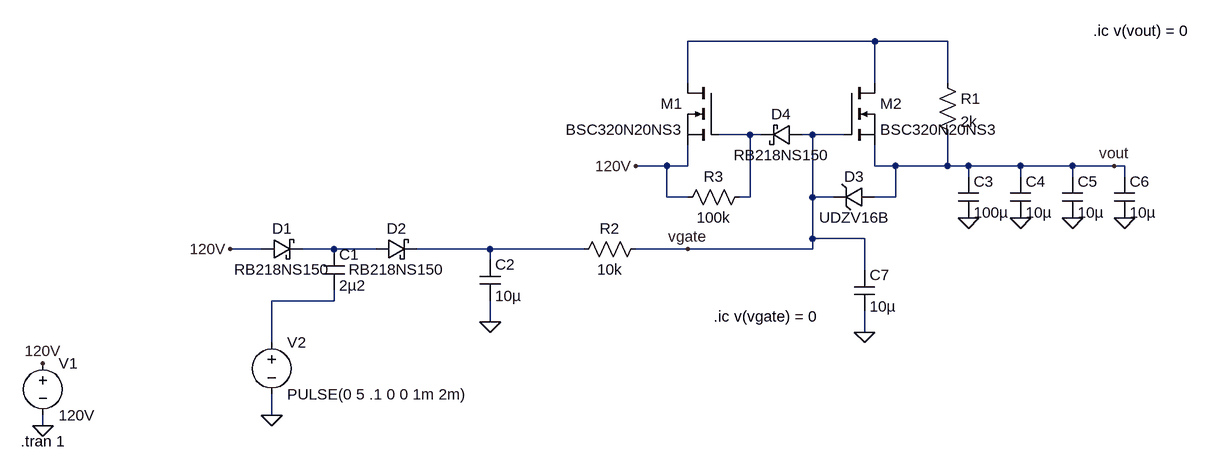
[diagram p0: schematic SoftStart+revPol_highVoltage.asc]
SoftStart+revPol_highVoltage.asc, the LTspice schematic file:
Version 4
SHEET 1 1836 680
WIRE 1344 -368 1056 -368
WIRE 1456 -368 1344 -368
WIRE 1056 -304 1056 -368
WIRE 1344 -304 1344 -368
WIRE 1456 -304 1456 -368
WIRE 1152 -224 1104 -224
WIRE 1168 -224 1152 -224
WIRE 1248 -224 1232 -224
WIRE 1296 -224 1248 -224
WIRE 1024 -176 976 -176
WIRE 1056 -176 1056 -208
WIRE 1056 -176 1024 -176
WIRE 1344 -176 1344 -208
WIRE 1376 -176 1344 -176
WIRE 1456 -176 1456 -224
WIRE 1456 -176 1376 -176
WIRE 1488 -176 1456 -176
WIRE 1568 -176 1488 -176
WIRE 1648 -176 1568 -176
WIRE 1712 -176 1648 -176
WIRE 1728 -176 1712 -176
WIRE 1488 -160 1488 -176
WIRE 1568 -160 1568 -176
WIRE 1648 -160 1648 -176
WIRE 1728 -160 1728 -176
WIRE 1024 -128 1024 -176
WIRE 1056 -128 1024 -128
WIRE 1152 -128 1152 -224
WIRE 1152 -128 1136 -128
WIRE 1248 -128 1248 -224
WIRE 1280 -128 1248 -128
WIRE 1376 -128 1376 -176
WIRE 1376 -128 1344 -128
WIRE 1248 -64 1248 -128
WIRE 1328 -64 1248 -64
WIRE 400 -48 352 -48
WIRE 512 -48 464 -48
WIRE 576 -48 512 -48
WIRE 752 -48 640 -48
WIRE 896 -48 752 -48
WIRE 1056 -48 976 -48
WIRE 1248 -48 1248 -64
WIRE 1248 -48 1056 -48
WIRE 752 -32 752 -48
WIRE 1328 -16 1328 -64
WIRE 512 32 512 16
WIRE 512 32 416 32
WIRE 752 64 752 32
WIRE 1328 80 1328 48
WIRE 416 96 416 32
WIRE 416 208 416 176
WIRE 64 224 64 208
FLAG 64 224 0
FLAG 64 128 120V
FLAG 416 208 0
FLAG 352 -48 120V
FLAG 752 64 0
FLAG 976 -176 120V
FLAG 1488 -96 0
FLAG 1568 -96 0
FLAG 1648 -96 0
FLAG 1728 -96 0
FLAG 1712 -176 vout
FLAG 1056 -48 vgate
FLAG 1328 80 0
SYMBOL voltage 64 112 R0
WINDOW 123 0 0 Left 0
WINDOW 39 0 0 Left 0
SYMATTR InstName V1
SYMATTR Value 120V
SYMBOL cap 496 -48 R0
SYMATTR InstName C1
SYMATTR Value 2µ2
SYMBOL voltage 416 80 R0
WINDOW 123 0 0 Left 0
WINDOW 39 0 0 Left 0
SYMATTR InstName V2
SYMATTR Value PULSE(0 5 .1 0 0 1m 2m)
SYMBOL schottky 400 -32 R270
WINDOW 0 32 32 VTop 2
WINDOW 3 0 32 VBottom 2
SYMATTR InstName D1
SYMATTR Value RB218NS150
SYMATTR Description Diode
SYMATTR Type diode
SYMBOL schottky 576 -32 R270
WINDOW 0 32 32 VTop 2
WINDOW 3 0 32 VBottom 2
SYMATTR InstName D2
SYMATTR Value RB218NS150
SYMATTR Description Diode
SYMATTR Type diode
SYMBOL cap 736 -32 R0
SYMATTR InstName C2
SYMATTR Value 10µ
SYMBOL nmos 1104 -304 M0
SYMATTR InstName M1
SYMATTR Value BSC320N20NS3
SYMBOL nmos 1296 -304 R0
SYMATTR InstName M2
SYMATTR Value BSC320N20NS3
SYMBOL cap 1472 -160 R0
SYMATTR InstName C3
SYMATTR Value 100µ
SYMATTR SpiceLine Rser=.2
SYMBOL cap 1552 -160 R0
SYMATTR InstName C4
SYMATTR Value 10µ
SYMBOL cap 1632 -160 R0
SYMATTR InstName C5
SYMATTR Value 10µ
SYMBOL cap 1712 -160 R0
SYMATTR InstName C6
SYMATTR Value 10µ
SYMBOL res 1440 -320 R0
SYMATTR InstName R1
SYMATTR Value 2k
SYMBOL res 992 -64 R90
WINDOW 0 0 56 VBottom 2
WINDOW 3 32 56 VTop 2
SYMATTR InstName R2
SYMATTR Value 10k
SYMBOL cap 1312 -16 R0
SYMATTR InstName C7
SYMATTR Value 10µ
SYMBOL zener 1344 -144 R90
WINDOW 0 0 32 VBottom 2
WINDOW 3 32 32 VTop 2
SYMATTR InstName D3
SYMATTR Value UDZV16B
SYMATTR Description Diode
SYMATTR Type diode
SYMBOL res 1152 -144 R90
WINDOW 0 0 56 VBottom 2
WINDOW 3 32 56 VTop 2
SYMATTR InstName R3
SYMATTR Value 100k
SYMBOL schottky 1232 -240 R90
WINDOW 0 0 32 VBottom 2
WINDOW 3 32 32 VTop 2
SYMATTR InstName D4
SYMATTR Value RB218NS150
SYMATTR Description Diode
SYMATTR Type diode
TEXT 30 248 Left 2 !.tran 1
TEXT 1680 -384 Left 2 !.ic v(vout) = 0
TEXT 1096 56 Left 2 !.ic v(vgate) = 0

The netlist it stands for:
* SoftStart+revPol_highVoltage.asc
V1 120V 0 120V
C1 N003 N005 2µ2
V2 N005 0 PULSE(0 5 .1 0 0 1m 2m)
D1 120V N003 RB218NS150
D2 N003 N004 RB218NS150
C2 N004 0 10µ
M1 N001 N002 120V 120V BSC320N20NS3
M2 N001 vgate vout vout BSC320N20NS3
C3 vout 0 100µ Rser=.2
C4 vout 0 10µ
C5 vout 0 10µ
C6 vout 0 10µ
R1 N001 vout 2k
R2 vgate N004 10k
C7 vgate 0 10µ
D3 vout vgate UDZV16B
R3 N002 120V 100k
D4 vgate N002 RB218NS150
.model D D
.lib standard.dio
.model NMOS NMOS
.model PMOS PMOS
.lib standard.mos
.tran 1
.ic v(vout) = 0
.ic v(vgate) = 0
.backanno
.end